# EAGLE design comcon_version_av_reducido (EAGLE 6.5.0)
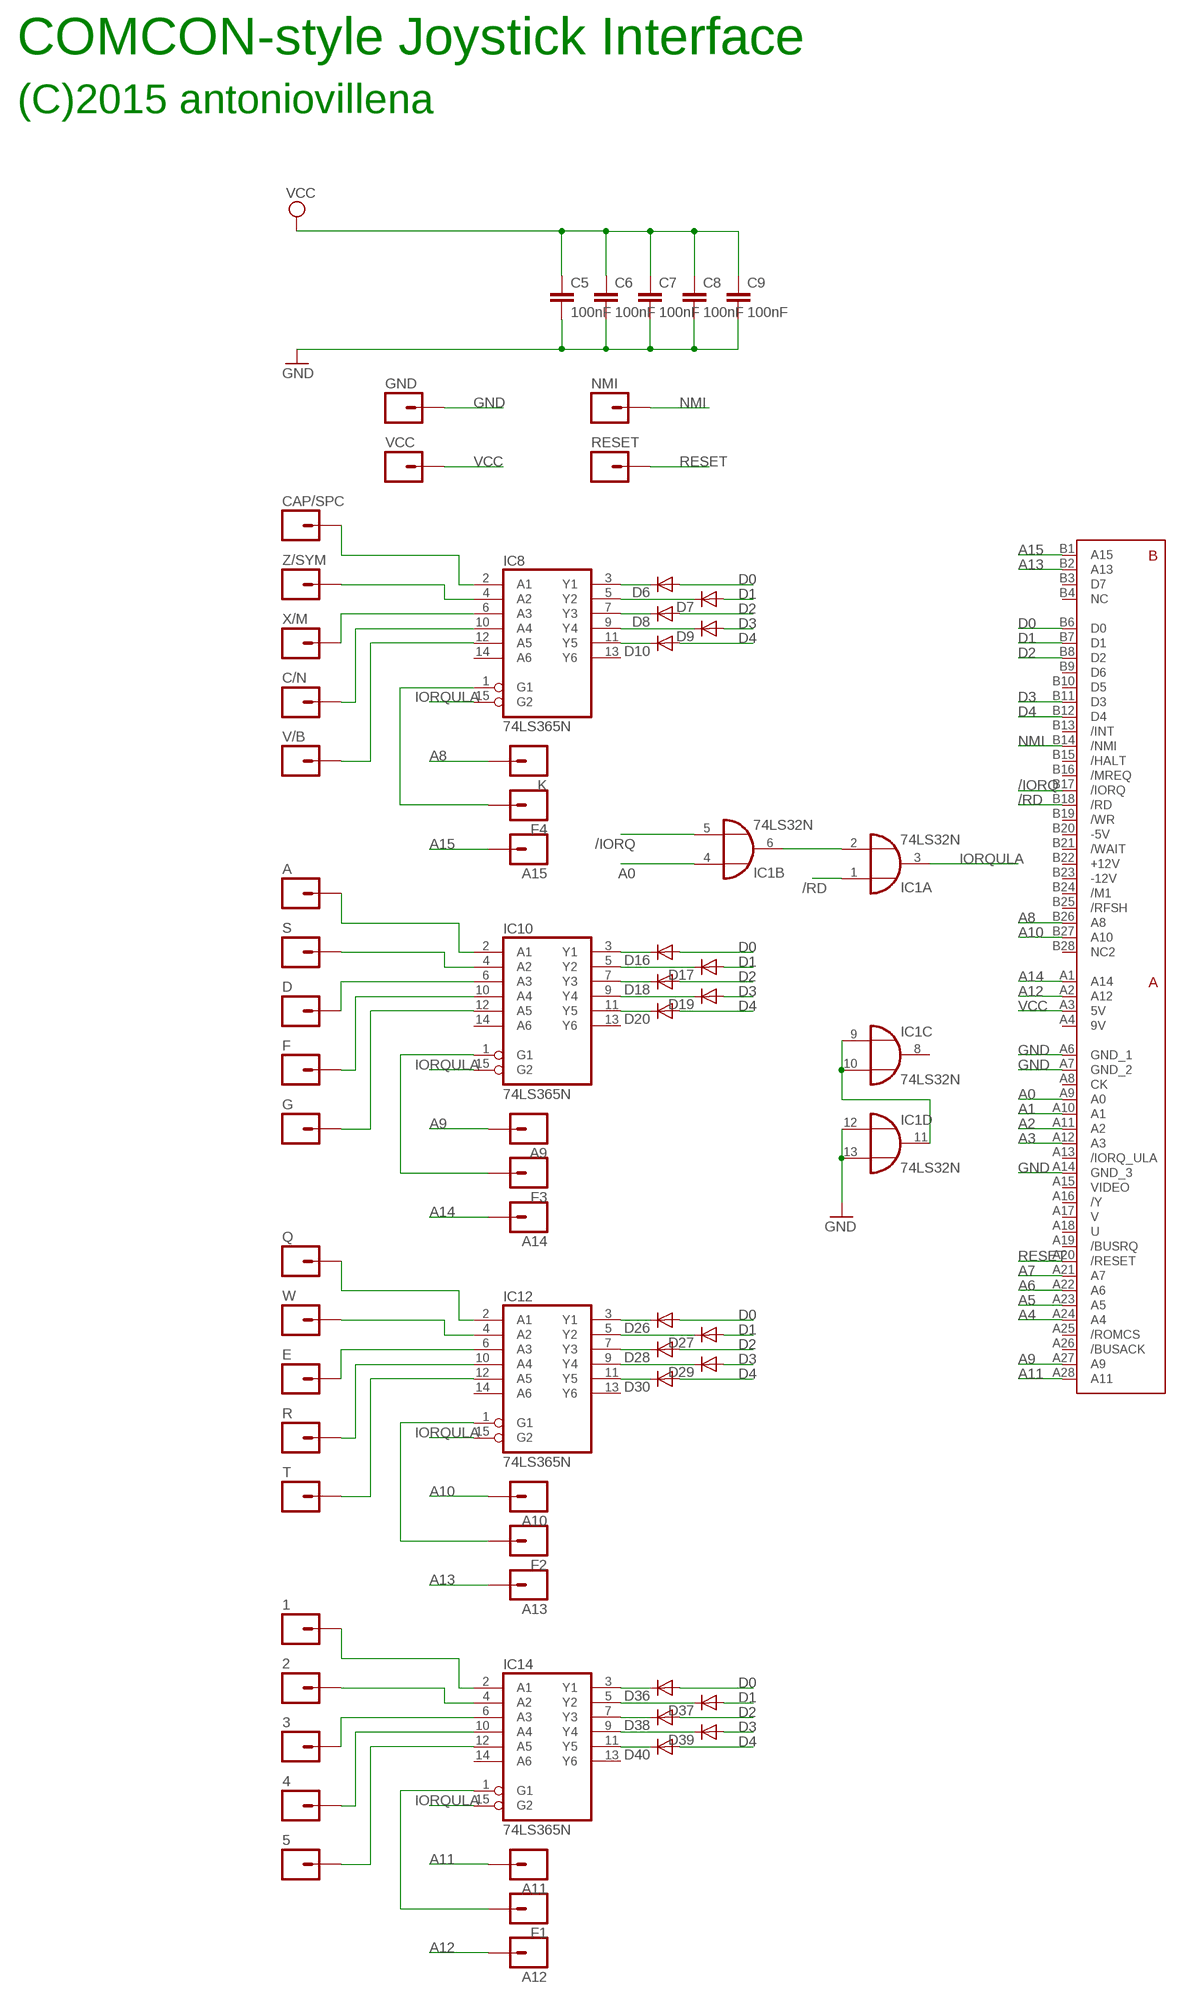
[diagram p0: schematic, sheet 1]

## Parts
1  M01PTH  [1X01]
2  M01PTH  [1X01]
3  M01PTH  [1X01]
4  M01PTH  [1X01]
5  M01PTH  [1X01]
A  M01PTH  [1X01]
A9  M01PTH  [1X01]
A10  M01PTH  [1X01]
A11  M01PTH  [1X01]
A12  M01PTH  [1X01]
A13  M01PTH  [1X01]
A14  M01PTH  [1X01]
A15  M01PTH  [1X01]
C5  100nF  C-EU050-025X075  [C050-025X075]
C6  100nF  C-EU050-025X075  [C050-025X075]
C7  100nF  C-EU050-025X075  [C050-025X075]
C8  100nF  C-EU050-025X075  [C050-025X075]
C9  100nF  C-EU050-025X075  [C050-025X075]
C/N  M01PTH  [1X01]
CAP/SPC  M01PTH  [1X01]
D  M01PTH  [1X01]
D6  1N4148DO35-7  [DO35-7]
D7  1N4148DO35-7  [DO35-7]
D8  1N4148DO35-7  [DO35-7]
D9  1N4148DO35-7  [DO35-7]
D10  1N4148DO35-7  [DO35-7]
D16  1N4148DO35-7  [DO35-7]
D17  1N4148DO35-7  [DO35-7]
D18  1N4148DO35-7  [DO35-7]
D19  1N4148DO35-7  [DO35-7]
D20  1N4148DO35-7  [DO35-7]
D26  1N4148DO35-7  [DO35-7]
D27  1N4148DO35-7  [DO35-7]
D28  1N4148DO35-7  [DO35-7]
D29  1N4148DO35-7  [DO35-7]
D30  1N4148DO35-7  [DO35-7]
D36  1N4148DO35-7  [DO35-7]
D37  1N4148DO35-7  [DO35-7]
D38  1N4148DO35-7  [DO35-7]
D39  1N4148DO35-7  [DO35-7]
D40  1N4148DO35-7  [DO35-7]
E  M01PTH  [1X01]
F  M01PTH  [1X01]
F1  M01PTH  [1X01]
F2  M01PTH  [1X01]
F3  M01PTH  [1X01]
F4  M01PTH  [1X01]
G  M01PTH  [1X01]
GND  M01PTH  [1X01]
IC1  74LS32N  [DIL14]
IC8  74LS365N  74HC365N  [DIL16]
IC10  74LS365N  74HC365N  [DIL16]
IC12  74LS365N  74HC365N  [DIL16]
IC14  74LS365N  74HC365N  [DIL16]
K  M01PTH  [1X01]
NMI  M01PTH  [1X01]
Q  M01PTH  [1X01]
R  M01PTH  [1X01]
RESET  M01PTH  [1X01]
S  M01PTH  [1X01]
T  M01PTH  [1X01]
U$3  ZXSP_ED2X28_SPE  [2X28_SPE]
V/B  M01PTH  [1X01]
VCC  M01PTH  [1X01]
W  M01PTH  [1X01]
X/M  M01PTH  [1X01]
Z/SYM  M01PTH  [1X01]

## Nets
/IORQ: IC1.5(B:I1) U$3.B17(/IORQ)
/RD: IC1.1(A:I0) U$3.B18(/RD)
A0: IC1.4(B:I0) U$3.A9(A0)
A1: U$3.A10(A1)
A2: U$3.A11(A2)
A3: U$3.A12(A3)
A4: U$3.A24(A4)
A5: U$3.A23(A5)
A6: U$3.A22(A6)
A7: U$3.A21(A7)
A8: K.1 U$3.B26(A8)
A9: A9.1 U$3.A27(A9)
A10: A10.1 U$3.B27(A10)
A11: A11.1 U$3.A28(A11)
A12: A12.1 U$3.A2(A12)
A13: A13.1 U$3.B2(A13)
A14: A14.1 U$3.A1(A14)
A15: A15.1 U$3.B1(A15)
D0: D6.A D16.A D26.A D36.A U$3.B6(D0)
D1: D7.A D17.A D27.A D37.A U$3.B7(D1)
D2: D8.A D18.A D28.A D38.A U$3.B8(D2)
D3: D9.A D19.A D29.A D39.A U$3.B11(D3)
D4: D10.A D20.A D30.A D40.A U$3.B12(D4)
GND [power]: C5.2 C6.2 C7.2 C8.2 C9.2 GND.1 IC1.12(D:I0) IC1.13(D:I1) U$3.A6(GND_1) U$3.A7(GND_2) U$3.A14(GND_3)
IORQULA: IC1.3(A:O) IC8.15(G2) IC10.15(G2) IC12.15(G2) IC14.15(G2)
N$1: IC1.2(A:I1) IC1.6(B:O)
N$2: F2.1 IC12.1(G1)
N$3: F4.1 IC8.1(G1)
N$4 [power]: IC1.9(C:I0) IC1.10(C:I1) IC1.11(D:O)
N$5: F3.1 IC10.1(G1)
N$6: F1.1 IC14.1(G1)
N$25: CAP/SPC.1 IC8.2(A1)
N$26: IC8.4(A2) Z/SYM.1
N$27: IC8.6(A3) X/M.1
N$28: C/N.1 IC8.10(A4)
N$47: IC8.12(A5) V/B.1
N$48: D6.C IC8.3(Y1)
N$49: D7.C IC8.5(Y2)
N$50: D8.C IC8.7(Y3)
N$51: D9.C IC8.9(Y4)
N$52: D10.C IC8.11(Y5)
N$63: A.1 IC10.2(A1)
N$64: IC10.4(A2) S.1
N$65: D.1 IC10.6(A3)
N$66: F.1 IC10.10(A4)
N$67: G.1 IC10.12(A5)
N$68: D16.C IC10.3(Y1)
N$69: D17.C IC10.5(Y2)
N$70: D18.C IC10.7(Y3)
N$71: D19.C IC10.9(Y4)
N$72: D20.C IC10.11(Y5)
N$84: IC12.2(A1) Q.1
N$85: IC12.4(A2) W.1
N$86: E.1 IC12.6(A3)
N$87: IC12.10(A4) R.1
N$88: IC12.12(A5) T.1
N$89: D26.C IC12.3(Y1)
N$90: D27.C IC12.5(Y2)
N$91: D28.C IC12.7(Y3)
N$92: D29.C IC12.9(Y4)
N$93: D30.C IC12.11(Y5)
N$104: 1.1 IC14.2(A1)
N$105: 2.1 IC14.4(A2)
N$106: 3.1 IC14.6(A3)
N$107: 4.1 IC14.10(A4)
N$108: 5.1 IC14.12(A5)
N$109: D36.C IC14.3(Y1)
N$110: D37.C IC14.5(Y2)
N$111: D38.C IC14.7(Y3)
N$112: D39.C IC14.9(Y4)
N$113: D40.C IC14.11(Y5)
NMI: NMI.1 U$3.B14(/NMI)
RESET: RESET.1 U$3.A20(/RESET)
VCC [power]: C5.1 C6.1 C7.1 C8.1 C9.1 U$3.A3(5V) VCC.1
Unconnected: IC1.8(C:O) IC8.13(Y6) IC8.14(A6) IC10.13(Y6) IC10.14(A6) IC12.13(Y6) IC12.14(A6) IC14.13(Y6) IC14.14(A6) U$3.A8(CK) U$3.A13(/IORQ_ULA) U$3.A15(VIDEO) U$3.A16(/Y) U$3.A17(V) U$3.A18(U) U$3.A19(/BUSRQ) U$3.A25(/ROMCS) U$3.A26(/BUSACK) U$3.B3(D7) U$3.B4(NC) U$3.B9(D6) U$3.B10(D5) U$3.B13(/INT) U$3.B15(/HALT) U$3.B16(/MREQ) U$3.B19(/WR) U$3.B21(/WAIT) U$3.B24(/M1) U$3.B25(/RFSH) U$3.B28(NC2)

## Notes on the sheet
- COMCON-style Joystick Interface
- (C)2015 antoniovillena

## Power pins joined to a net without a drawn wire
9V: U$3.A4(9V)
+12V: U$3.B22(+12V)
-5V: U$3.B20(-5V)
-12V: U$3.B23(-12V)
GND: IC1.7(P:GND) IC8.8(GND) IC10.8(GND) IC12.8(GND) IC14.8(GND)
VCC: IC1.14(P:VCC) IC8.16(VCC) IC10.16(VCC) IC12.16(VCC) IC14.16(VCC)

## Library data of the parts
1-5 A A9-A15 C/N CAP/SPC D E F F1-F4 G GND K NMI Q R RESET S T V/B VCC W X/M Z/SYM = SparkFun-Connectors:M01: Header 1 Standard 1-pin 0.1" header. Use with straight break away headers (SKU : PRT-00116), right angle break away headers (PRT-00553), swiss pins (PRT-00743), machine pins (PRT-00117), and female headers (PRT-00115).
C5-C9 = rcl:C-EU: CAPACITOR, European symbol
D6-D10 D16-D20 D26-D30 D36-D40 = diode:1N4148: DIODE high speed (Philips)
IC1 = 74xx-eu:74*32: Quad 2-input OR gate
IC8 IC10 IC12 IC14 = 74xx-eu:74*365: Hex BUS DRIVER, 3-state
U$3 = zx_edge:ZXSP_ED

## Net classes
1 power: width 0.508 mm, clearance 0.254 mm to class 0, clearance 0.254 mm

## Board
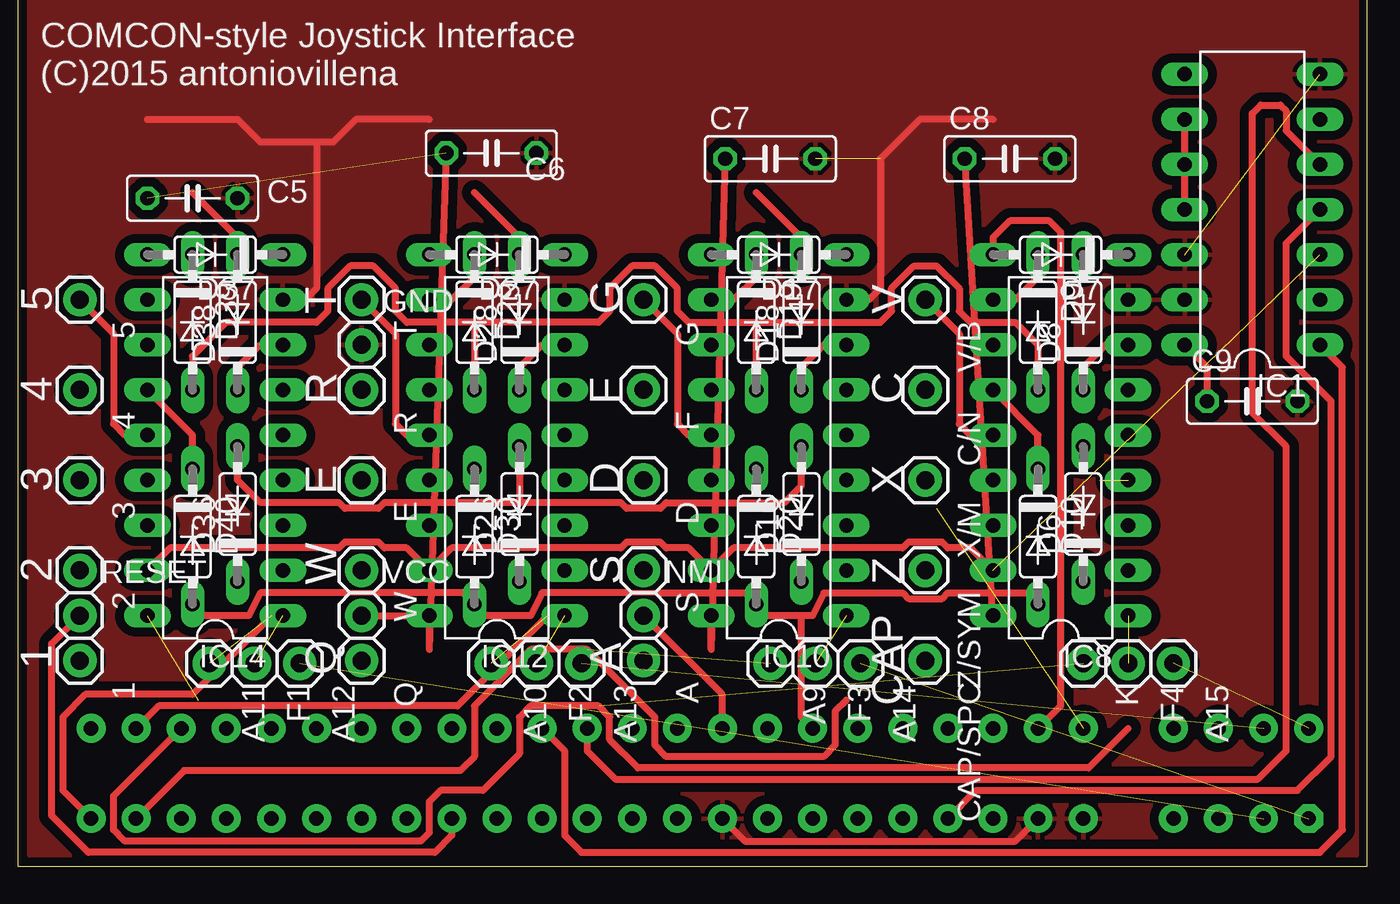
[diagram p1: board, top side]
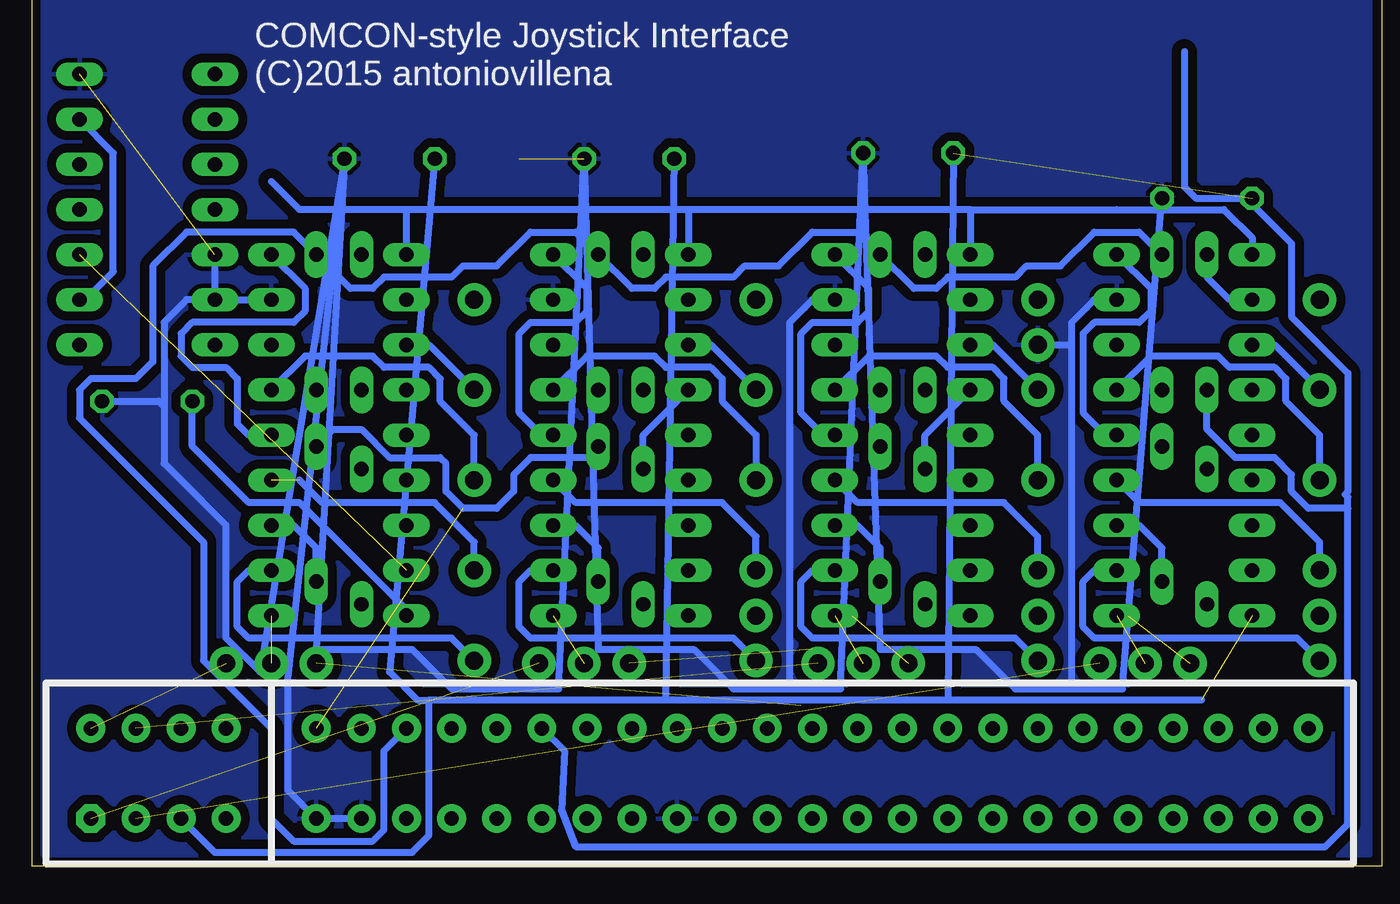
[diagram p2: board, bottom side, seen from below]

No outline drawn. Coordinates in mm, seen from the top.
Copper layers (1*16): Top 0.035mm / dielectric 1.5mm / Bottom 0.035mm
Design rules "seedstudio_Fusion_eagle_rule_v1.1 *": minimum track width 7mil, minimum drill 12mil, track to track 8mil, track to pad 10mil, pad to pad 6mil, via to via 10mil, smd to smd 0mil, copper to edge 10mil, drill to drill 10mil, minimum pad ring 10mil, minimum via ring 6mil, stop-mask expansion 2mil, vias tented up to drill 100mil, thermal gap 10mil
Milling: 4 lines

### Footprints (pad centres in the part's own frame; a part is rotated, then mirrored left to right if it is on the bottom)
1X01 = drill 1.016 pad 1.88: 1 0,0
C050-025X075 = drill 0.813 octagon: 1 -2.54,0; 2 2.54,0
DO35-7 = drill 0.813 long: A 3.81,0; C -3.81,0
DIL14 = drill 0.813 long: 1 -7.62,-3.81; 2 -5.08,-3.81; 3 -2.54,-3.81; 4 0,-3.81; 5 2.54,-3.81; 6 5.08,-3.81; 7 7.62,-3.81; 8 7.62,3.81; 9 5.08,3.81; 10 2.54,3.81; 11 0,3.81; 12 -2.54,3.81; 13 -5.08,3.81; 14 -7.62,3.81
DIL16 = drill 0.813 long: 1 -8.89,-3.81; 2 -6.35,-3.81; 3 -3.81,-3.81; 4 -1.27,-3.81; 5 1.27,-3.81; 6 3.81,-3.81; 7 6.35,-3.81; 8 8.89,-3.81; 9 8.89,3.81; 10 6.35,3.81; 11 3.81,3.81; 12 1.27,3.81; 13 -1.27,3.81; 14 -3.81,3.81; 15 -6.35,3.81; 16 -8.89,3.81
2X28_SPE = drill 0.813 pad 1.626 octagon: A1 0,-5.08 | drill 0.813 pad 1.626: A2 2.54,-5.08; A3 5.08,-5.08; A4 7.62,-5.08; A6 12.7,-5.08; A7 15.24,-5.08; A8 17.78,-5.08; A9 20.32,-5.08; A10 22.86,-5.08; A11 25.4,-5.08; A12 27.94,-5.08; A13 30.48,-5.08; A14 33.02,-5.08; A15 35.56,-5.08; A16 38.1,-5.08; A17 40.64,-5.08; A18 43.18,-5.08; A19 45.72,-5.08; A20 48.26,-5.08; A21 50.8,-5.08; A22 53.34,-5.08; A23 55.88,-5.08; A24 58.42,-5.08; A25 60.96,-5.08; A26 63.5,-5.08; A27 66.04,-5.08; A28 68.58,-5.08; B1 0,0; B2 2.54,0; B3 5.08,0; B4 7.62,0; B6 12.7,0; B7 15.24,0; B8 17.78,0; B9 20.32,0; B10 22.86,0; B11 25.4,0; B12 27.94,0; B13 30.48,0; B14 33.02,0; B15 35.56,0; B16 38.1,0; B17 40.64,0; B18 43.18,0; B19 45.72,0; B20 48.26,0; B21 50.8,0; B22 53.34,0; B23 55.88,0; B24 58.42,0; B25 60.96,0; B26 63.5,0; B27 66.04,0; B28 68.58,0

### Placement (x,y rotation side)
1  3.49,11.59 270 top
2  3.49,16.67 270 top
3  3.49,21.75 270 top
4  3.49,26.83 270 top
5  3.49,31.91 270 top
A  35.24,11.59 270 top
A9  42.39,11.43 270 top
A10  26.67,11.43 270 top
A11  10.79,11.43 270 top
A12  15.88,11.43 270 top
A13  31.75,11.43 270 top
A14  47.47,11.43 270 top
A15  65.09,11.43 270 top
C5  9.84,37.62 0 top
C6  26.67,40.16 0 top
C7  42.39,39.85 0 top
C8  55.88,39.85 0 top
C9  69.53,26.19 0 top
C/N  51.12,26.83 270 top
CAP/SPC  51.12,11.59 270 top
D  35.24,21.75 270 top
D6  60.01,19.84 90 top
D7  58.74,34.45 180 top
D8  60.01,30.64 90 top
D9  57.47,30.64 270 top
D10  57.47,18.57 270 top
D16  44.13,19.84 90 top
D17  42.86,34.45 180 top
D18  44.13,30.64 90 top
D19  41.59,30.64 270 top
D20  41.59,18.57 270 top
D26  28.26,19.84 90 top
D27  26.99,34.45 180 top
D28  28.26,30.64 90 top
D29  25.72,30.64 270 top
D30  25.72,18.57 270 top
D36  12.38,19.84 90 top
D37  11.11,34.45 180 top
D38  12.38,30.64 90 top
D39  9.84,30.64 270 top
D40  9.84,18.57 270 top
E  19.37,21.75 270 top
F  35.24,26.83 270 top
F1  13.34,11.43 270 top
F2  29.21,11.43 270 top
F3  44.93,11.43 270 top
F4  62.55,11.43 270 top
G  35.24,31.91 270 top
GND  19.37,29.37 0 top
IC1  69.53,36.99 90 top
IC8  58.74,23.02 90 top
IC10  42.86,23.02 90 top
IC12  26.99,23.02 90 top
IC14  11.11,23.02 90 top
K  60.01,11.43 270 top
NMI  35.24,14.13 0 top
Q  19.37,11.59 270 top
R  19.37,26.83 270 top
RESET  3.49,14.13 0 top
S  35.24,16.67 270 top
T  19.37,31.91 270 top
U$3  72.71,7.78 0 bottom
V/B  51.12,31.91 270 top
VCC  19.37,14.13 0 top
W  19.37,16.67 270 top
X/M  51.12,21.75 270 top
Z/SYM  51.12,16.67 270 top

### Tracks (layer width: path | path; a pad name or v marks a point on that pad's centre or on a via)
/IORQ
  Top 0.406: U$3.B17 32.07,6.51 33.66,4.92 69.85,4.92 71.44,6.51 71.44,23.65 69.53,25.56 69.53,42.39 70.01,42.86 71.12,42.86 71.44,42.55 71.44,41.43 IC1.5
/RD
  Top 0.406: U$3.B18 30.8,6.51 30.8,1.75 31.75,0.79 73.34,0.79 74.61,2.06 74.61,28.1 IC1.1
A0
  Top 0.406: U$3.A9 53.98,4.29 72.07,4.29 73.98,6.19 73.98,26.19 71.44,28.73 71.44,35.08 IC1.4
A8  (1 unrouted)
  Top 0.406: U$3.B26 5.4,3.97 5.4,2.06 6.03,1.43 22.7,1.43 23.18,1.91 23.18,3.65 23.81,4.29 26.19,4.29 28.26,6.35 28.26,8.41 28.89,9.05 32.7,9.05 33.34,8.41 33.34,7.14 34.92,5.56 60.33,5.56 62.55,7.78
A9  (1 unrouted)
  Top 0.406: 46.67,9.37 46.04,8.73 46.04,6.83 45.4,6.19 36.51,6.19 35.88,6.83 35.88,8.41 32.07,12.22 28.89,12.22 25.72,9.05 25.72,6.19 24.92,5.4 9.37,5.4 U$3.A27
A10  (1 unrouted)
  Top 0.406: 29.84,14.13 24.77,9.05 7.94,9.05 U$3.B27
A11  (1 unrouted)
  Top 0.406: 14.29,14.13 9.84,9.68 3.81,9.68 2.54,8.41 2.54,4.29 U$3.A28
A12  (1 unrouted)
A13  (1 unrouted)
A14  (1 unrouted)
A15  (1 unrouted)
D0  (1 unrouted)
  Top 0.406: D26.A 28.26,20.48 | 28.26,20.48 33.97,20.48 34.29,20.16 36.2,20.16 36.51,20.48 43.18,20.48 44.13,21.43 D16.A | 28.26,20.48 20.64,20.48 20.32,20.16 18.41,20.16 18.1,20.48 13.65,20.48 12.38,21.75 D36.A
  Bottom 0.406: D6.A 59.05,24.61 57.47,24.61 55.88,23.02 53.02,23.02 52.7,22.7 52.7,21.11 51.75,20.16 49.85,20.16 48.9,21.11 48.9,22.07 47.94,23.02 44.77,23.02 D16.A
D1
  Top 0.406: U$3.B7 58.74,9.05 58.74,35.72 58.1,36.35 55.88,36.35 54.93,35.4 D7.A
  Bottom 0.406: 23.18,36.99 D27.A | 39.05,36.99 D17.A | 54.93,36.99 60.96,36.99 62.55,38.58 | D7.A 54.93,36.99 | 23.18,36.99 14.92,36.99 8.89,36.99 7.3,35.4 D37.A | 23.18,36.99 30.8,36.99 39.05,36.99 | 39.05,36.99 46.67,36.99 54.93,36.99
D2
  Top 0.406: 25.72,37.94 28.26,35.4 D28.A | 9.84,37.94 12.38,35.4 D38.A | 41.59,37.94 44.13,35.4 D18.A
  Bottom 0.406: D38.A 13.65,35.72 16.19,35.72 18.1,33.81 20,33.81 20.64,33.18 24.45,33.18 25.08,32.54 26.35,32.54 D28.A 29.53,35.72 32.07,35.72 33.97,33.81 35.88,33.81 36.51,33.18 40.32,33.18 40.96,32.54 42.23,32.54 D18.A 45.4,35.72 47.94,35.72 49.85,33.81 51.75,33.81 52.39,33.18 56.2,33.18 56.83,32.54 58.1,32.54 D8.A 61.28,35.72 67.31,35.72 69.22,33.81 69.22,28.42 70.17,27.46 72.71,27.46 73.34,26.83 73.34,25.24 66.36,18.26 66.36,11.59 62.55,7.78 62.55,2.7 61.28,1.43 56.83,1.43 56.2,2.06 56.2,6.51 U$3.B8
D3
  Top 0.406: D19.A 41.59,30.64 | 25.72,30.64 D29.A | 25.72,30.64 32.7,30.64 33.34,31.27 33.34,32.54 34.61,33.81 35.88,33.81 37.15,32.54 37.15,31.27 37.78,30.64 41.59,30.64 | 25.72,30.64 21.91,30.64 21.27,31.27 21.27,32.54 20,33.81 18.73,33.81 17.46,32.54 17.46,31.27 16.83,30.64 11.75,30.64 9.84,28.73 D39.A | D9.A 57.47,29.37 56.2,30.64 53.66,30.64 53.02,31.27 53.02,32.54 51.75,33.81 50.48,33.81 49.21,32.54 49.21,31.27 48.58,30.64 41.59,30.64
  Bottom 0.406: 11.11,45.88 11.11,38.26 10.48,37.62 7.62,37.62 5.08,35.08 5.08,30.96 1.91,27.78 1.91,21.11 2.06,20.95 1.91,20.8 1.91,20.16 | 1.91,20.16 4.13,20.16 5.08,21.11 5.08,22.07 6.03,23.02 8.26,23.02 9.84,24.61 D39.A | U$3.B11 46.04,6.51 46.2,3.17 45.4,1.11 3.17,1.11 1.91,2.38 1.91,20.16
D4
  Top 0.305: 36.2,15.4 34.29,15.4 | 20.32,15.4 18.41,15.4
  Top 0.406: 36.2,15.4 40.96,15.4 D20.A 42.23,14.13 44.13,14.13 | 20.32,15.4 25.08,15.4 D30.A 26.35,14.13 28.89,14.13 29.53,15.4 34.29,15.4 | 44.13,14.13 44.77,14.13 45.4,15.4 49.85,15.4 50.16,15.08 52.07,15.08 52.39,15.4 56.83,15.4 D10.A | 18.41,15.4 13.65,15.4 13.02,14.13 10.48,14.13 D40.A | U$3.B12 44.13,8.41 44.13,14.13
GND  (2 unrouted)
  Top 0.406: 23.18,42.07 19.05,42.07 17.78,40.8 16.83,40.8 | 16.83,40.8 16.83,32.54 16.19,31.91 IC14.8 | 54.93,42.07 50.8,42.07 48.58,39.85 48.58,32.54 47.94,31.91 IC10.8 | U$3.A14 40.96,1.43 56.2,1.43 U$3.A7 | 7.3,42.07 12.38,42.07 13.65,40.8 16.83,40.8
  Bottom 0.406: 33.34,10 33.34,30.64 32.07,31.91 IC12.8 | 17.46,10 17.46,29.37 | 17.46,29.37 17.46,30.64 16.19,31.91 IC14.8 | C8.2 63.18,10.95 65.09,12.86 65.09,19.21 68.58,22.7 68.58,25.88 | IC1.13 IC8.8 | IC1.12 IC1.13 | U$3.A7 U$3.A6 61.59,4.29 61.59,10.64 C8.2 | IC1.13 67.31,31.91 68.58,30.64 68.58,25.88 | C8.2 60.01,12.22 54.61,12.22 52.39,10 46.35,10 C7.2 44.13,12.22 38.73,12.22 36.51,10 33.34,10 | 33.34,10 30.48,10 C6.2 28.26,12.22 22.86,12.22 20.64,10 17.46,10 | 17.46,10 14.61,10 C5.2 | C9.2 68.9,26.19 68.58,25.88 | GND.1 17.46,29.37
  pour Top (isolate 0.508): 0.64,0.64 75.41,0.64 75.41,75.25 0.64,75.25
  pour Bottom (isolate 0.508): 0.64,0.64 75.41,0.64 75.41,75.25 0.64,75.25
IORQULA  (1 unrouted)
  Top 0.406: IC8.15 53.66,17.94 52.39,17.94 52.07,18.26 50.16,18.26 49.85,17.94 40.32,17.94 IC10.15 37.78,17.94 36.51,17.94 36.2,18.26 34.29,18.26 33.97,17.94 24.45,17.94 IC12.15 21.91,17.94 20.64,17.94 20.32,18.26 18.41,18.26 18.1,17.94 8.57,17.94 IC14.15
N$1
  Bottom 0.406: IC1.2 73.03,31.91 71.44,33.5 71.44,40.16 IC1.6
N$2  (1 unrouted)
N$3  (1 unrouted)
N$4
  Top 0.406: IC1.11 IC1.10 IC1.9
N$5  (1 unrouted)
N$6  (1 unrouted)
N$25
  Bottom 0.406: CAP/SPC.1 52.39,12.86 63.82,12.86 64.45,13.49 64.45,16.03 63.82,16.67 IC8.2
N$26  (1 unrouted)
  Bottom 0.406: Z/SYM.1 51.12,18.26 53.34,20.48 59.69,20.48 60.96,21.75
N$27
  Bottom 0.406: X/M.1 51.12,24.29 53.02,26.19 53.02,27.46 53.66,28.1 56.2,28.1 56.83,28.73 60.64,28.73 IC8.6
N$28
  Bottom 0.406: IC8.10 53.66,29.37 C/N.1
N$47
  Top 0.406: V/B.1 53.02,30 53.02,24.92 53.66,24.29 IC8.12
N$48
  Bottom 0.406: D6.C 60.01,17.94 61.28,19.21 IC8.3
N$49
  Bottom 0.406: D7.C 60.64,32.54 60.64,31.27 61.28,30.64 66.99,30.64 67.63,30 67.63,28.73 66.99,28.1 65.09,28.1 64.45,27.46 64.45,24.92 63.82,24.29 IC8.5
N$50
  Top 0.406: IC8.7 61.28,29.37 60.01,28.1 D8.C
N$51
  Top 0.406: D9.C 57.47,33.18 56.2,31.91 IC8.9
N$52
  Top 0.406: D10.C 57.47,24.29 IC8.11
N$63
  Bottom 0.406: A.1 36.51,12.86 47.94,12.86 48.58,13.49 48.58,16.03 47.94,16.67 IC10.2
N$64
  Bottom 0.406: S.1 35.24,18.57 37.15,20.48 45.4,20.48 IC10.4
N$65
  Bottom 0.406: D.1 35.24,24.29 37.15,26.19 37.15,27.46 37.78,28.1 40.32,28.1 40.96,28.73 44.77,28.73 IC10.6
N$66
  Bottom 0.406: F.1 37.78,29.37 IC10.10
N$67
  Top 0.406: G.1 37.15,30 37.15,24.92 37.78,24.29 IC10.12
N$68
  Bottom 0.406: D16.C 44.13,17.94 45.4,19.21 IC10.3
N$69
  Bottom 0.406: IC10.5 47.31,24.29 48.58,25.56 48.58,30 47.94,30.64 45.4,30.64 44.77,31.27 44.77,32.54 D17.C
N$70
  Top 0.406: IC10.7 45.4,29.37 44.13,28.1 D18.C
N$71
  Top 0.406: D19.C 41.59,33.18 40.32,31.91 IC10.9
N$72
  Bottom 0.406: D20.C 41.59,24.29 IC10.11
N$84
  Bottom 0.406: Q.1 20.64,12.86 32.07,12.86 32.7,13.49 32.7,16.03 32.07,16.67 IC12.2
N$85
  Bottom 0.406: W.1 19.37,18.57 21.27,20.48 29.53,20.48 IC12.4
N$86
  Bottom 0.406: E.1 19.37,24.29 21.27,26.19 21.27,27.46 21.91,28.1 24.45,28.1 25.08,28.73 28.89,28.73 IC12.6
N$87
  Bottom 0.406: R.1 21.91,29.37 IC12.10
N$88
  Top 0.406: T.1 21.27,30 21.27,24.92 21.91,24.29 IC12.12
N$89
  Bottom 0.406: IC12.3 29.53,19.21 28.26,17.94 D26.C
N$90
  Bottom 0.406: IC12.5 31.43,24.29 32.7,25.56 32.7,30 32.07,30.64 29.53,30.64 28.89,31.27 28.89,32.54 D27.C
N$91
  Top 0.406: D28.C 28.26,28.1 29.53,29.37 IC12.7
N$92
  Top 0.406: D29.C 25.72,33.18 24.45,31.91 IC12.9
N$93
  Bottom 0.406: D30.C 25.72,24.29 IC12.11
N$104
  Bottom 0.406: 1.1 4.76,12.86 16.19,12.86 16.83,13.49 16.83,16.03 16.19,16.67 IC14.2
N$105
  Bottom 0.406: 2.1 3.49,18.26 5.71,20.48 13.65,20.48 IC14.4
N$106
  Bottom 0.406: 3.1 3.49,24.29 5.4,26.19 5.4,27.46 6.03,28.1 8.57,28.1 9.21,28.73 13.02,28.73 IC14.6
N$107
  Bottom 0.406: 4.1 6.03,29.37 IC14.10
N$108
  Top 0.406: 5.1 5.4,30 5.4,24.92 6.03,24.29 IC14.12
N$109
  Bottom 0.406: D36.C 12.38,17.94 13.65,19.21 IC14.3
N$110
  Bottom 0.406: D37.C 13.02,32.54 13.02,31.27 13.65,30.64 16.19,30.64 16.83,30 16.83,25.56 15.56,24.29 IC14.5
N$111
  Top 0.406: D38.C 12.38,28.1 13.65,29.37 IC14.7
N$112
  Bottom 0.406: D39.C 9.84,33.18 8.57,31.91 IC14.9
N$113
  Top 0.406: D40.C 9.84,24.29 IC14.11
NMI
  Top 0.406: U$3.B14 39.69,9.68 NMI.1
RESET
  Top 0.406: U$3.A20 24.45,1.75 23.5,0.79 3.97,0.79 1.91,2.86 1.91,12.54 RESET.1
VCC  (2 unrouted)
  Top 0.406: C7.1 39.05,12.22 IC10.16 | C6.1 23.18,12.22 IC12.16 VCC.1 | IC8.16 C8.1 | C9.1 66.99,28.1 IC1.14
  Bottom 0.406: U$3.A3 65.72,0.79 54.61,0.79 53.66,1.75 53.66,9.37 | C8.1 55.88,10.95 54.29,9.37 53.66,9.37 | 40.32,9.37 C7.1 | 10.16,9.37 24.45,9.37 | 24.45,9.37 40.32,9.37 | 40.32,9.37 53.66,9.37 | C6.1 24.45,9.37 | IC8.16 54.93,14.45 60.96,20.48 63.82,20.48 66.99,23.65 C9.1

### Text on the board
tPlace: 5 | T | G | V | 4 | R | F | C | 3 | E | D | X | 2 | W | S | Z | 1 | Q | A | CAP
tNames: COMCON-style Joystick Interface / (C)2015 antoniovillena
bNames: COMCON-style Joystick Interface / (C)2015 antoniovillena